# EAGLE schematic mainboard (EAGLE 9.5.1)
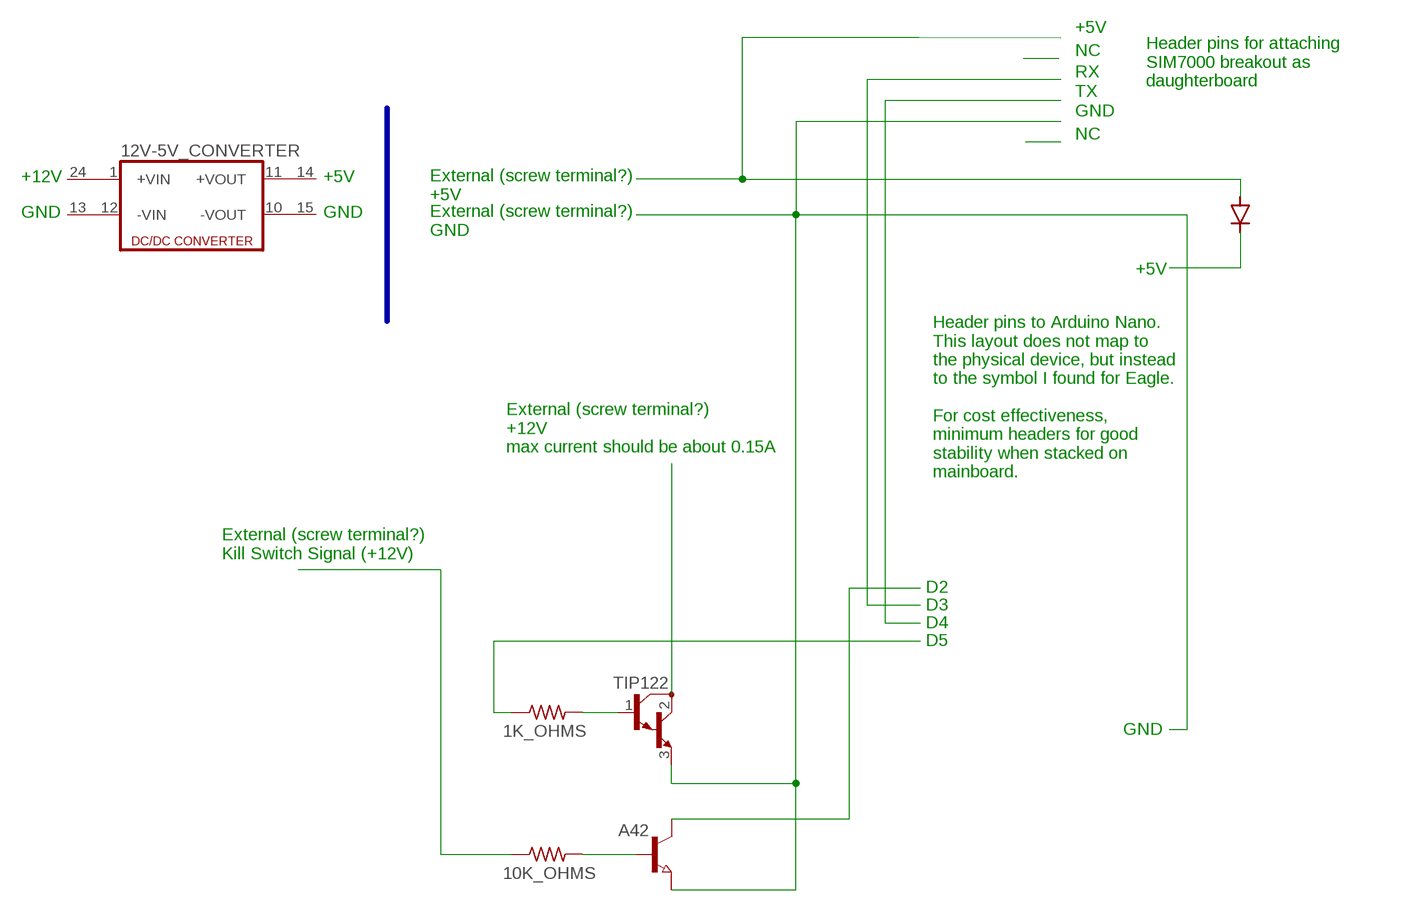
[diagram p0: schematic, sheet 1]

## Parts
1K_OHMS  R-US_0411/15  [0411/15]
10K_OHMS  R-US_0411/15  [0411/15]
12V-5V_CONVERTER  DC213R  [CMK]
A42  NPN-TRANSISTOR_SOT23  [SOT23]
D2  1N5400  [DO201-15]
Q1  TIP122  [TO220]

## Nets
N$3: Q1.2(C)
N$6: 1K_OHMS.1
N$9: D2.A
N$10: D2.C
N$14: 10K_OHMS.2 A42.1(B)
N$15: A42.3(C)
N$16: 1K_OHMS.2 Q1.1(B)
N$21: 10K_OHMS.1
N$22: A42.2(E) Q1.3(E)
Unconnected: 12V-5V_CONVERTER.1(+VIN) 12V-5V_CONVERTER.10(-VOUT) 12V-5V_CONVERTER.11(+VOUT) 12V-5V_CONVERTER.12(-VIN) 12V-5V_CONVERTER.13(-VIN1) 12V-5V_CONVERTER.14(+VOUT1) 12V-5V_CONVERTER.15(-VOUT1) 12V-5V_CONVERTER.24(+VIN1)

## Buses
B$1

## Notes on the sheet
- +5V
- NC
- RX
- Header pins for attaching
  SIM7000 breakout as
  daughterboard
- TX
- GND
- NC
- +12V | +5V
- External (screw terminal?)
  +5V
- GND | GND
- External (screw terminal?)
  GND
- +5V
- External (screw terminal?)
  +12V
  max current should be about 0.15A
- Header pins to Arduino Nano.
  This layout does not map to
  the physical device, but instead
  to the symbol I found for Eagle.
  
  For cost effectiveness,
  minimum headers for good
  stability when stacked on
  mainboard.
- External (screw terminal?)
  Kill Switch Signal (+12V)
- D2
- D3
- D4
- D5
- GND

## Library data of the parts
1K_OHMS 10K_OHMS = rcl:R-US_: RESISTOR, American symbol; SPICEPREFIX: R
12V-5V_CONVERTER = dc-dc-converter:DC213R: DC-DC CONVERTER; OC_FARNELL: unknown; OC_NEWARK: unknown
A42 = semicon-smd-ipc:NPN-TRANSISTOR_: NPN TRANSISTOR
D2 = diode:1N5400: DIODE standard rectifier, 3 A, 50 V (Motorola)
Q1 = transistor-npn:TIP122*: NPN Darlington Transistor